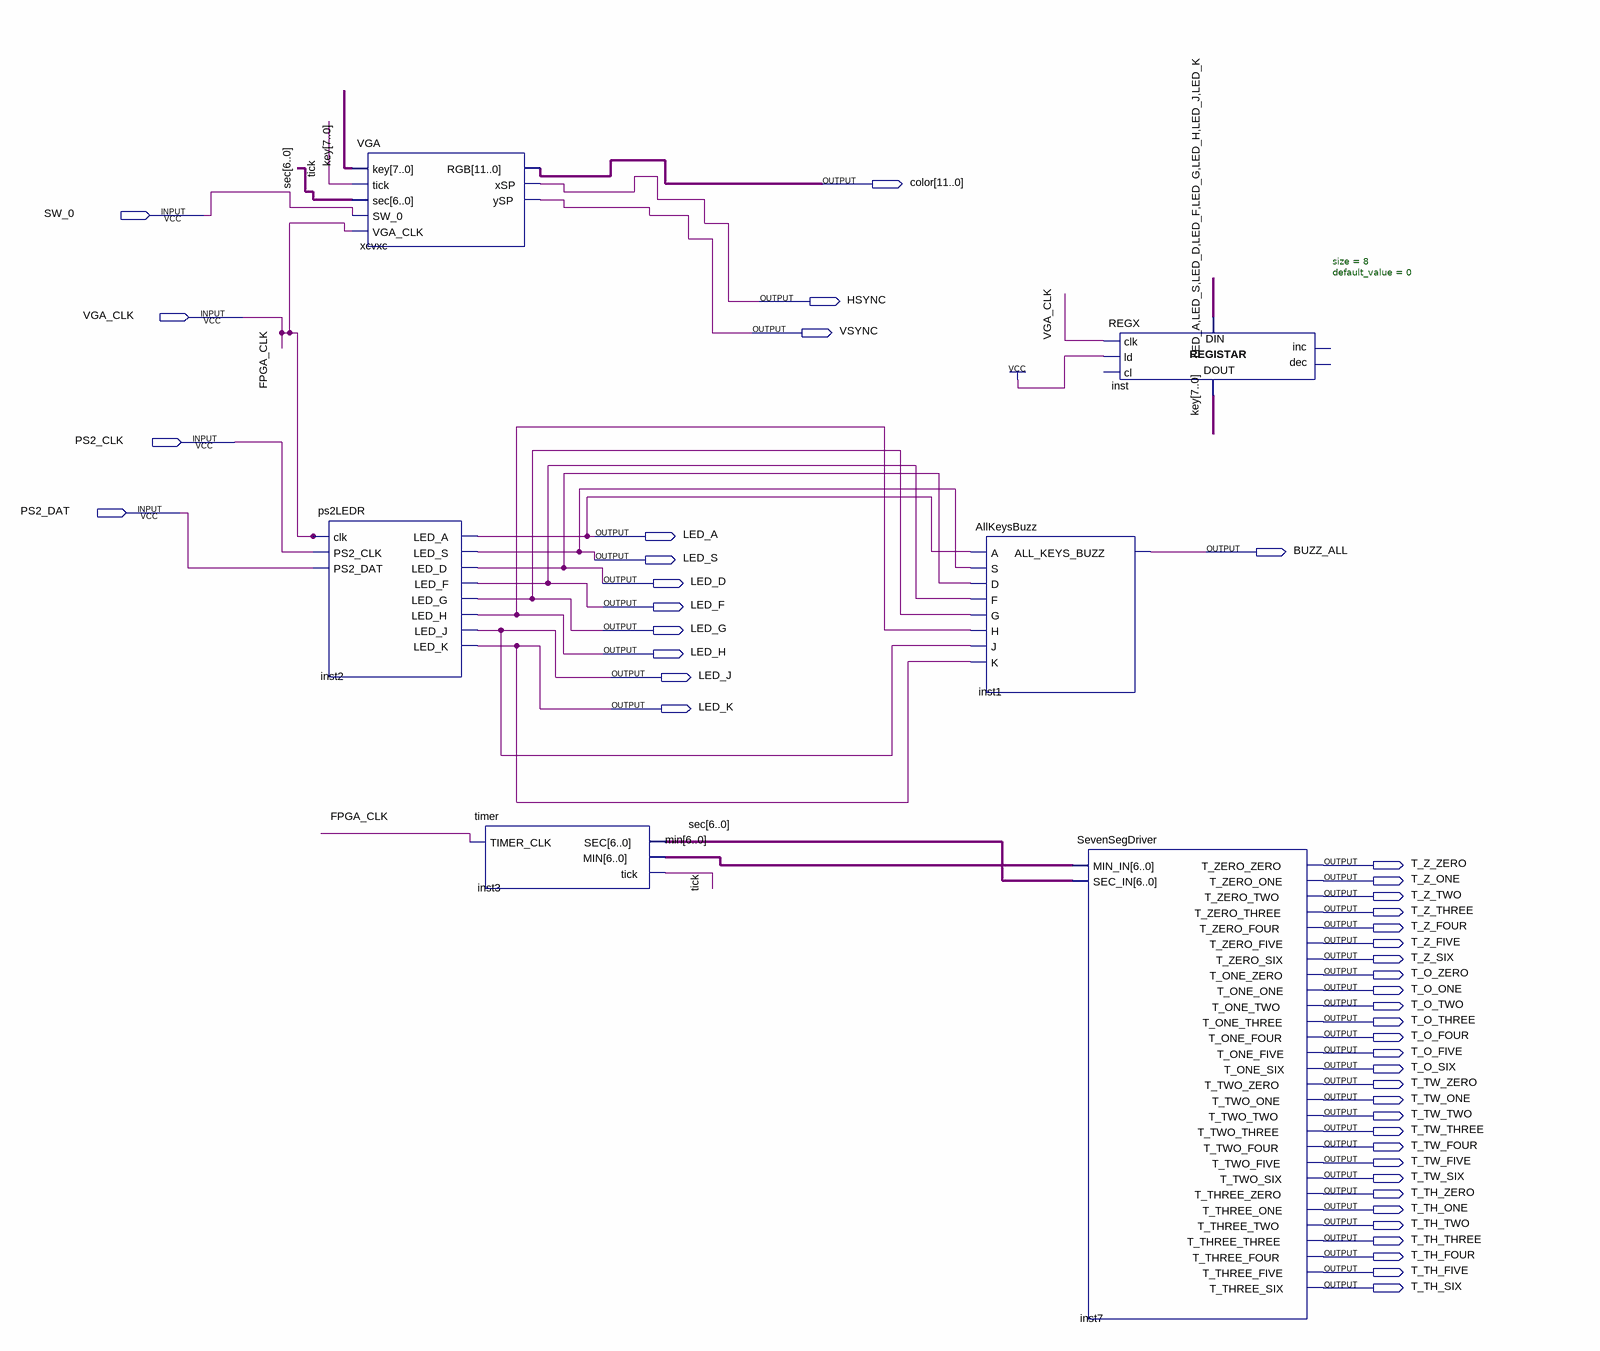
[diagram p0: schematic sheet]
// Quartus schematic TeslaPP.bdf as structural Verilog: 6 symbols, 44 pins
module TeslaPP (
  input  SW_0,
  input  VGA_CLK,
  input  PS2_CLK,
  input  PS2_DAT,
  output [11:0] color,
  output HSYNC,
  output VSYNC,
  output LED_A,
  output BUZZ_ALL,
  output LED_S,
  output LED_D,
  output LED_F,
  output LED_G,
  output LED_H,
  output LED_J,
  output LED_K,
  output T_Z_ZERO,
  output T_Z_ONE,
  output T_Z_TWO,
  output T_Z_THREE,
  output T_Z_FOUR,
  output T_Z_FIVE,
  output T_Z_SIX,
  output T_O_ZERO,
  output T_O_ONE,
  output T_O_TWO,
  output T_O_THREE,
  output T_O_FOUR,
  output T_O_FIVE,
  output T_O_SIX,
  output T_TW_ZERO,
  output T_TW_ONE,
  output T_TW_TWO,
  output T_TW_THREE,
  output T_TW_FOUR,
  output T_TW_FIVE,
  output T_TW_SIX,
  output T_TH_ZERO,
  output T_TH_ONE,
  output T_TH_TWO,
  output T_TH_THREE,
  output T_TH_FOUR,
  output T_TH_FIVE,
  output T_TH_SIX
);

  wire tick;
  wire [6:0] min, sec;
  wire [7:0] key;

  ps2LEDR inst2 (
    .clk(VGA_CLK), .PS2_CLK(PS2_CLK), .PS2_DAT(PS2_DAT), .LED_A(LED_A), .LED_S(LED_S), .LED_D(LED_D),
    .LED_F(LED_F), .LED_G(LED_G), .LED_H(LED_H), .LED_J(LED_J), .LED_K(LED_K));
  VGA xcvxc (.key(key), .tick(tick), .sec(sec), .SW_0(SW_0), .VGA_CLK(VGA_CLK), .RGB(color), .xSP(HSYNC), .ySP(VSYNC));
  timer inst3 (.TIMER_CLK(VGA_CLK), .SEC(sec), .MIN(min), .tick(tick));
  AllKeysBuzz inst1 (
    .A(LED_A), .S(LED_S), .D(LED_D), .F(LED_F), .G(LED_G), .H(LED_H), .J(LED_J), .K(LED_K),
    .ALL_KEYS_BUZZ(BUZZ_ALL));
  REGX #(.size(8), .default_value(0)) inst (
    .clk(VGA_CLK), .ld(1'b1), .data_in({LED_A, LED_S, LED_D, LED_F, LED_G, LED_H, LED_J, LED_K}),
    .data_out(key));  // open: cl, inc, dec
  SevenSegDriver inst7 (
    .MIN_IN(min), .SEC_IN(sec), .T_ZERO_ZERO(T_Z_ZERO), .T_ZERO_ONE(T_Z_ONE), .T_ZERO_TWO(T_Z_TWO),
    .T_ZERO_THREE(T_Z_THREE), .T_ZERO_FOUR(T_Z_FOUR), .T_ZERO_FIVE(T_Z_FIVE), .T_ZERO_SIX(T_Z_SIX),
    .T_ONE_ZERO(T_O_ZERO), .T_ONE_ONE(T_O_ONE), .T_ONE_TWO(T_O_TWO), .T_ONE_THREE(T_O_THREE),
    .T_ONE_FOUR(T_O_FOUR), .T_ONE_FIVE(T_O_FIVE), .T_ONE_SIX(T_O_SIX), .T_TWO_ZERO(T_TW_ZERO),
    .T_TWO_ONE(T_TW_ONE), .T_TWO_TWO(T_TW_TWO), .T_TWO_THREE(T_TW_THREE), .T_TWO_FOUR(T_TW_FOUR),
    .T_TWO_FIVE(T_TW_FIVE), .T_TWO_SIX(T_TW_SIX), .T_THREE_ZERO(T_TH_ZERO), .T_THREE_ONE(T_TH_ONE),
    .T_THREE_TWO(T_TH_TWO), .T_THREE_THREE(T_TH_THREE), .T_THREE_FOUR(T_TH_FOUR), .T_THREE_FIVE(T_TH_FIVE),
    .T_THREE_SIX(T_TH_SIX));

  // Other names for the same wires on the sheet: FPGA_CLK = VGA_CLK
endmodule
